# Altium schematic sheet 原理图.SchDoc
size A4; SheetNumber: 1; SheetTotal: 1
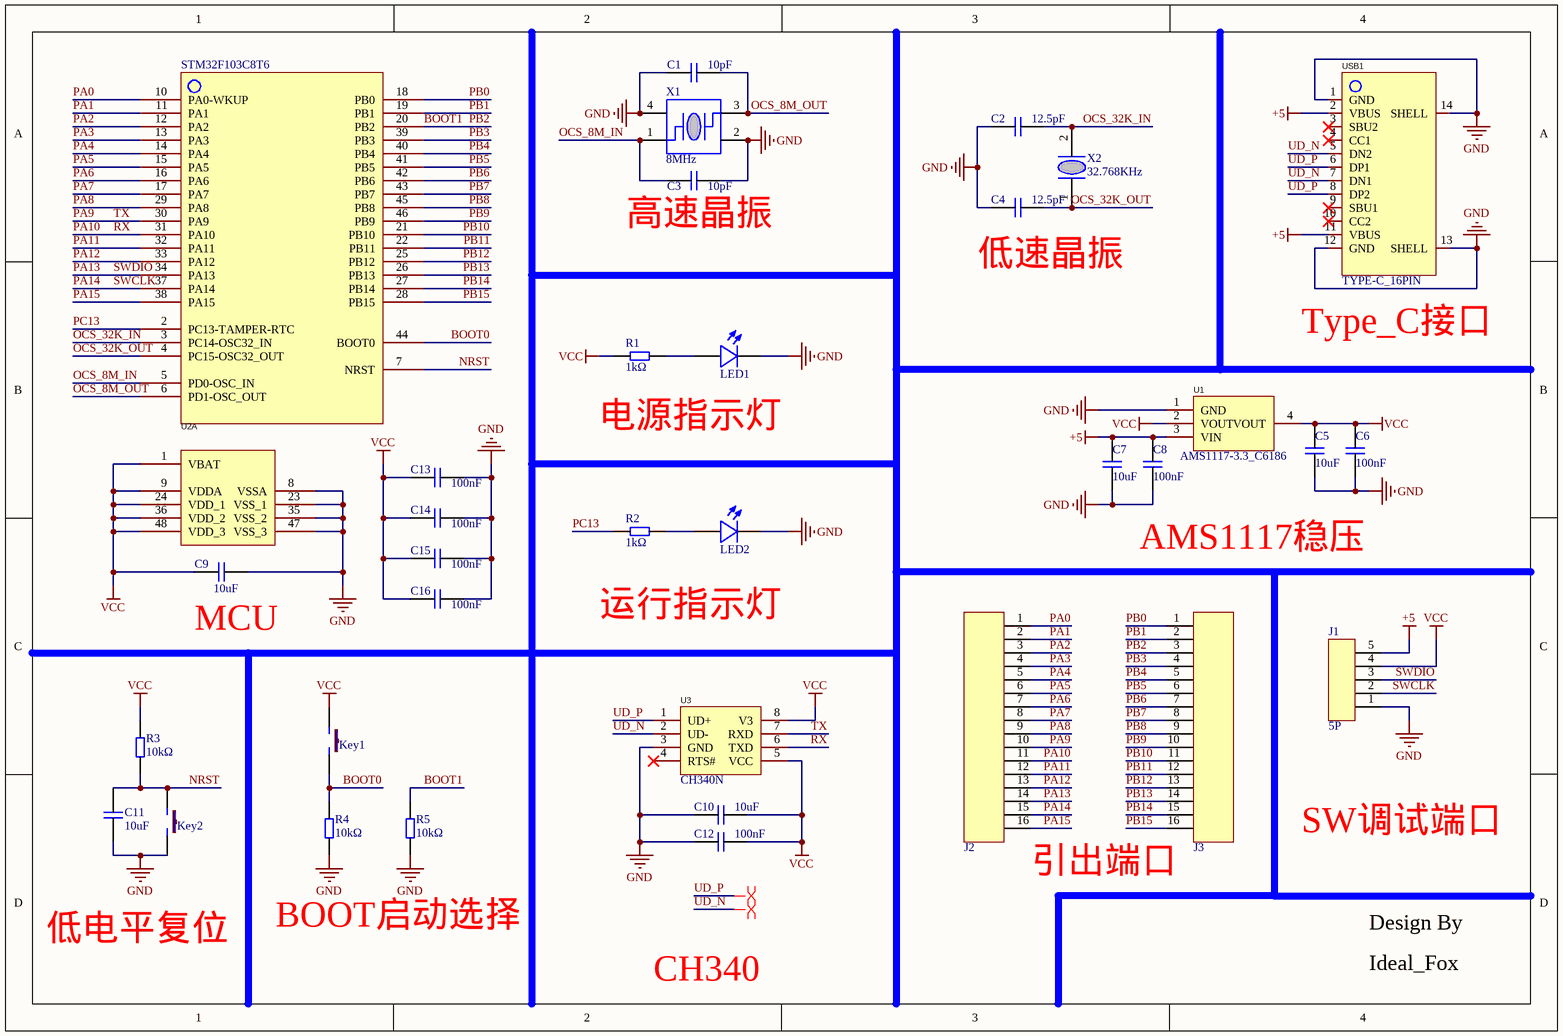
[diagram p0: 原理图.SchDoc]

## Parts
C1  10pF  [C0603]
C2  12.5pF  [C0603]
C3  10pF  [C0603]
C4  12.5pF  [C0603]
C5  10uF  [C0603]
C6  100nF  [C0603]
C7  10uF  [C0603]
C8  100nF  [C0603]
C9  10uF  [C0603]
C10  10uF  [C0603]
C11  10uF  [C0603]
C12  100nF  [C0603]
C13  100nF  [C0603]
C14  100nF  [C0603]
C15  100nF  [C0603]
C16  100nF  [C0603]
J1  5P  [5P-P2.54]
J2  2x10P  [2X10P-P2.54]  (value not drawn)
J3  2x10P  [2X10P-P2.54]  (value not drawn)
Key1  KEY  [SW_2P]  (value not drawn)
Key2  KEY  [SW_2P]  (value not drawn)
LED1  LED_R  [LED0805]  (value not drawn)
LED2  LED_R  [LED0805]  (value not drawn)
R1  1kΩ  [R0603]
R2  1kΩ  [R0603]
R3  10kΩ  [R0603]
R4  10kΩ  [R0603]
R5  10kΩ  [R0603]
U1  AMS1117-3.3_C6186  [SOT-223-3_L6.5-W3.4-P2.30-LS7.0-BR]
U2  STM32F103C8T6  [STM32F103C8T6]  (parts A,B of 2)
U3  CH340N  [SOP-8_L4.9-W3.9-P1.27-LS6.0-BL]
USB1  TYPE-C_16PIN  [USB-C-SMD_TYPE-C-16PIN]
X1  8MHz  [SMD_4P_5032]
X2  32.768KHz  [SMD_2P_3215]

## Nets
+5: C7.2 C8.2 J1.5 U1.3(VIN) USB1.2(VBUS) USB1.11(VBUS)
GND: C1.1 C2.1 C3.2 C4.1 C5.1 C6.1 C7.1 C8.1 C9.2 C10.1 C11.2 C12.1 C13.1 C14.1 C15.1 C16.1 J1.1 Key2.2 LED1.2 LED2.2 R4.2 R5.2 U1.1(GND) U2.8(VSSA) U2.23(VSS_1) U2.35(VSS_2) U2.47(VSS_3) U3.3(GND) USB1.1(GND) USB1.12(GND) USB1.13(SHELL) USB1.14(SHELL) X1.2 X1.4
VCC: C5.2 C6.2 C9.1 C10.2 C12.2 C13.2 C14.2 C15.2 C16.2 J1.4 Key1.1 R1.1 R3.1 U1.2(VOUT) U1.4(VOUT) U2.1(VBAT) U2.9(VDDA) U2.24(VDD_1) U2.36(VDD_2) U2.48(VDD_3) U3.5(VCC) U3.8(V3)
BOOT0: Key1.2 R4.1 U2.44(BOOT0)
BOOT1: J3.3 R5.1 U2.20(PB2)  [also labelled PB2]
NRST: C11.1 Key2.1 R3.2 U2.7(NRST)
OCS_8M_IN: C3.1 U2.5(PD0-OSC_IN) X1.1
OCS_8M_OUT: C1.2 U2.6(PD1-OSC_OUT) X1.3
OCS_32K_IN: C2.2 U2.3(PC14-OSC32_IN) X2.2
OCS_32K_OUT: C4.2 U2.4(PC15-OSC32_OUT) X2.1
PA0: J2.1 U2.10(PA0-WKUP)
PA1: J2.2 U2.11(PA1)
PA2: J2.3 U2.12(PA2)
PA3: J2.4 U2.13(PA3)
PA4: J2.5 U2.14(PA4)
PA5: J2.6 U2.15(PA5)
PA6: J2.7 U2.16(PA6)
PA7: J2.8 U2.17(PA7)
PA8: J2.9 U2.29(PA8)
PA9: J2.10 U2.30(PA9) U3.7(RXD)  [also labelled TX]
PA10: J2.11 U2.31(PA10) U3.6(TXD)  [also labelled RX]
PA11: J2.12 U2.32(PA11)
PA12: J2.13 U2.33(PA12)
PA13: J1.3 J2.14 U2.34(PA13)  [also labelled SWDIO]
PA14: J1.2 J2.15 U2.37(PA14)  [also labelled SWCLK]
PA15: J2.16 U2.38(PA15)
PB0: J3.1 U2.18(PB0)
PB1: J3.2 U2.19(PB1)
PB3: J3.4 U2.39(PB3)
PB4: J3.5 U2.40(PB4)
PB5: J3.6 U2.41(PB5)
PB6: J3.7 U2.42(PB6)
PB7: J3.8 U2.43(PB7)
PB8: J3.9 U2.45(PB8)
PB9: J3.10 U2.46(PB9)
PB10: J3.11 U2.21(PB10)
PB11: J3.12 U2.22(PB11)
PB12: J3.13 U2.25(PB12)
PB13: J3.14 U2.26(PB13)
PB14: J3.15 U2.27(PB14)
PB15: J3.16 U2.28(PB15)
PC13: R2.1 U2.2(PC13-TAMPER-RTC)
UD_N: U3.2(UD-) USB1.5(DN2) USB1.7(DN1)
UD_P: U3.1(UD+) USB1.6(DP1) USB1.8(DP2)
NetLED1_1: LED1.1 R1.2
NetLED2_1: LED2.1 R2.2

Not connected (* = marked no-connect by the designer): U3 4(RTS#)*; USB1 3(SBU2)* 4(CC1)* 9(SBU1)* 10(CC2)*

## Layout directives
differential pair: UD_N, UD_P

## Notes on the sheet
- (near C3) 高速晶振
- (near C4) 低速晶振
- Type_C接口
- 电源指示灯
- AMS1117稳压
- (near C9) MCU
- 运行指示灯
- SW调试端口
- (near J2) 引出端口
- 低电平复位
- BOOT启动选择
- CH340
- Design By
- Ideal_Fox

## Library data of the parts
C1-C16 = CAP
LED1 LED2 = LED
R1-R5 = RES
U1 = AMS1117-3.3: Manufacturer: AMS; Add into BOM: yes; Output Type: 固定; Output Voltage: 3.3V; MAX Output Current: 1A; Power Supply Rejection Ratio (PSRR): 72dB@(120Hz); Dropout Voltage: 1.3V@(800mA); Output Polarity: 正极; Number of Outputs: 1; Symbol: AMS1117-3.3; Device: AMS1117-3.3_C6186; Supplier: LCSC; Manufacturer Part: AMS1117-3.3; Supplier Part: C6186; JLCPCB Part Class: Basic Part; LCSC Part Name: 输出3.3V 1A; Supplier Footprint: SOT-223-3; Datasheet: https://atta.szlcsc.com/upload/public/pdf/source/20180727/C6186_7A095716F0823C02F1997A905E26C086.pdf; Convert to PCB: yes; Maximum Input Voltage: -; standby current: -; Noise: -; Feature: -; Operating Temperature: -
U2 = STM32F103C8T6: Manufacturer: ST(意法半导体); Add into BOM: yes; CPU Core: CM3; Program Storage Size: 64KB; RAM Size: 20KB; GPIO Ports Number: 37; Operating Voltage Range: 2V~3.6V; CPU Maximum Speed: 72MHz; Program Memory Type: FLASH; ADC (Bit): 12bit; Universal Serial Bus: 有; Peripheral/Function: 看门狗；DMA；看门狗；片载温度传感器; Symbol: STM32F103C8T6; Device: STM32F103C8T6; LCSC Part Name: STM32F103C8T6 MSL=3; Supplier Part: C8734; Manufacturer Part: STM32F103C8T6; Supplier Footprint: LQFP-48(7x7); JLCPCB Part Class: Extended Part; Datasheet: https://atta.szlcsc.com/upload/public/pdf/source/20220812/8363ACEC51AD55ECEB84799464F7CB85.pdf; Supplier: LCSC; Convert to PCB: yes; Operating Temperature Range: -40℃~+85℃; DAC (Bit): -; PWM (Bit): -; Internal Comparator: -; communication protocol: -; Watchdog: 有; Real-Time Clock: -; Infrared Data Association: 有; Low-Voltage Detect: 有; CCP Capture/Compare: -; Secure Digital Input and Output: -; Direct Memory Access: 有; Internal Oscillator: 有
U3 = CH340N: Manufacturer: WCH(南京沁恒); Symbol: CH340N_C2977777; Add into BOM: yes; Device: CH340N; LCSC Part Name: USB转串口芯片 CH340; Supplier Part: C2977777; Manufacturer Part: CH340N; Supplier Footprint: SOP-8; JLCPCB Part Class: Extended Part; Datasheet: https://atta.szlcsc.com/upload/public/pdf/source/20230530/6E401E9554E9F5311886CC8B3F89B62E.pdf; Supplier: LCSC; Convert to PCB: yes
USB1 = TYPE-C_16PIN: Manufacturer: SHOU HAN(首韩); Symbol: TYPE-C 16PIN 2MD(073); Add into BOM: yes; Connector Type: Type-C; Gender: 母; Number of Ports: 1; Number of Contacts: 16P; Current Rating - Power (Max): 5A; Device: TYPE-C 16PIN 2MD(073); Supplier: LCSC; Supplier Part: C2765186; Manufacturer Part: TYPE-C 16PIN 2MD(073); JLCPCB Part Class: Extended Part; LCSC Part Name: Type-C 母 卧贴; Supplier Footprint: SMD; Datasheet: https://atta.szlcsc.com/upload/public/pdf/source/20211123/39B17C16241EAC15C5E277BDA434118E.pdf; Convert to PCB: yes; Standard: -; Mounting Style: 卧贴; Operating Temperature Range: -25℃~+85℃
X1 = 晶振
X2 = 晶振_1